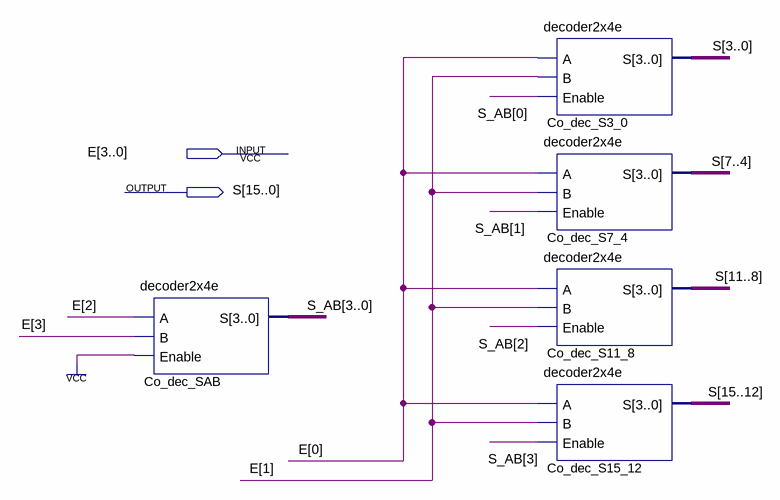
[diagram p0: schematic sheet]
// Quartus schematic decoder4x16e.bdf as structural Verilog: 5 symbols, 2 pins
module decoder4x16e (
  input  [3:0] E,
  output [15:0] S
);

  wire [3:0] S_AB;

  decoder2x4e Co_dec_SAB (.A(E[2]), .B(E[3]), .Enable(1'b1), .S(S_AB));
  decoder2x4e Co_dec_S3_0 (.A(E[0]), .B(E[1]), .Enable(S_AB[0]), .S(S[3:0]));
  decoder2x4e Co_dec_S7_4 (.A(E[0]), .B(E[1]), .Enable(S_AB[1]), .S(S[7:4]));
  decoder2x4e Co_dec_S11_8 (.A(E[0]), .B(E[1]), .Enable(S_AB[2]), .S(S[11:8]));
  decoder2x4e Co_dec_S15_12 (.A(E[0]), .B(E[1]), .Enable(S_AB[3]), .S(S[15:12]));
endmodule
